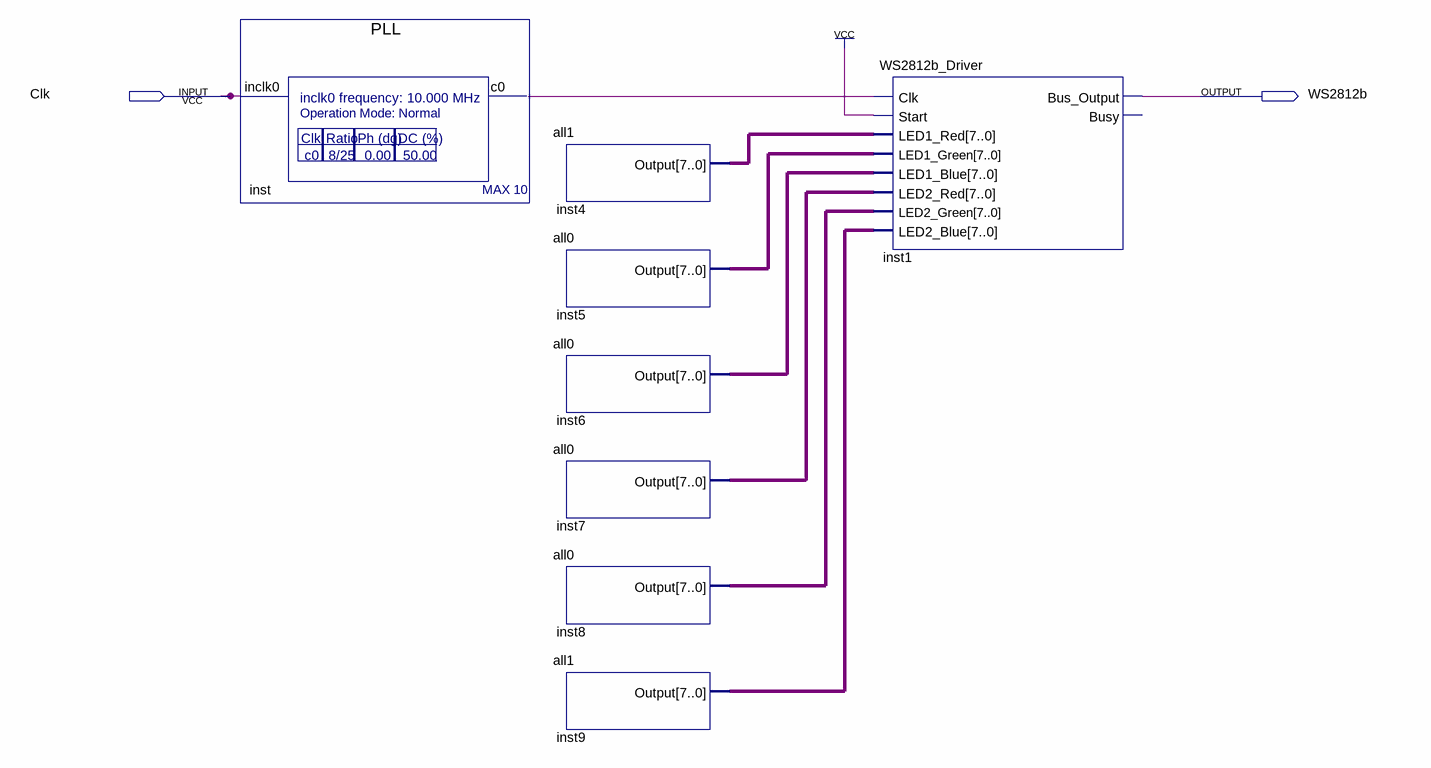
[diagram p0: schematic sheet]
// Quartus schematic 04-WS2812b.bdf as structural Verilog: 8 symbols, 2 pins
module \04-WS2812b  (
  input  Clk,
  output WS2812b
);

  wire inst_c0;
  wire [7:0] inst4_output, inst5_output, inst6_output, inst7_output, inst8_output, inst9_output;

  PLL inst (.inclk0(Clk), .c0(inst_c0));
  all1 inst4 (.Output(inst4_output));
  all0 inst5 (.Output(inst5_output));
  all0 inst6 (.Output(inst6_output));
  all0 inst7 (.Output(inst7_output));
  all0 inst8 (.Output(inst8_output));
  all1 inst9 (.Output(inst9_output));
  WS2812b_Driver inst1 (
    .Clk(inst_c0), .Start(1'b1), .LED1_Red(inst4_output), .LED1_Green(inst5_output),
    .LED1_Blue(inst6_output), .LED2_Red(inst7_output), .LED2_Green(inst8_output), .LED2_Blue(inst9_output),
    .Bus_Output(WS2812b));  // open: Busy
endmodule
